# Altium schematic sheet rpi_connector.SchDoc
size A
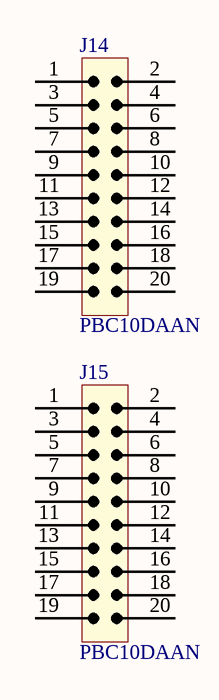
[diagram p0: rpi_connector.SchDoc]

## Parts
J14  MFG P/N: PBC10DAAN  [HEADER_20_POS JUMPER]  (hidden comment: CONN_HEADER_2X10_POS_0.1_INCH_JUMPER)
J15  MFG P/N: PBC10DAAN  [HEADER_20_POS JUMPER]  (hidden comment: CONN_HEADER_2X10_POS_0.1_INCH_JUMPER)

## Nets

Not connected (* = marked no-connect by the designer): J14 1 2 3 4 5 6 7 8 9 10 11 12 13 14 15 16 17 18 19 20; J15 1 2 3 4 5 6 7 8 9 10 11 12 13 14 15 16 17 18 19 20

## Library data of the parts
J14 J15 = 384: CONN, HDR, TH, STR, 2X10, 2.54mmP; ID: 384; MFG: Sullins Connector Solutions; COMMON: 210-00137-00; XPN: XS-10003880; Status: In Development; RoHS Compliant: Yes; LOON: 210-00137-00; Gecko: 210-00137-00